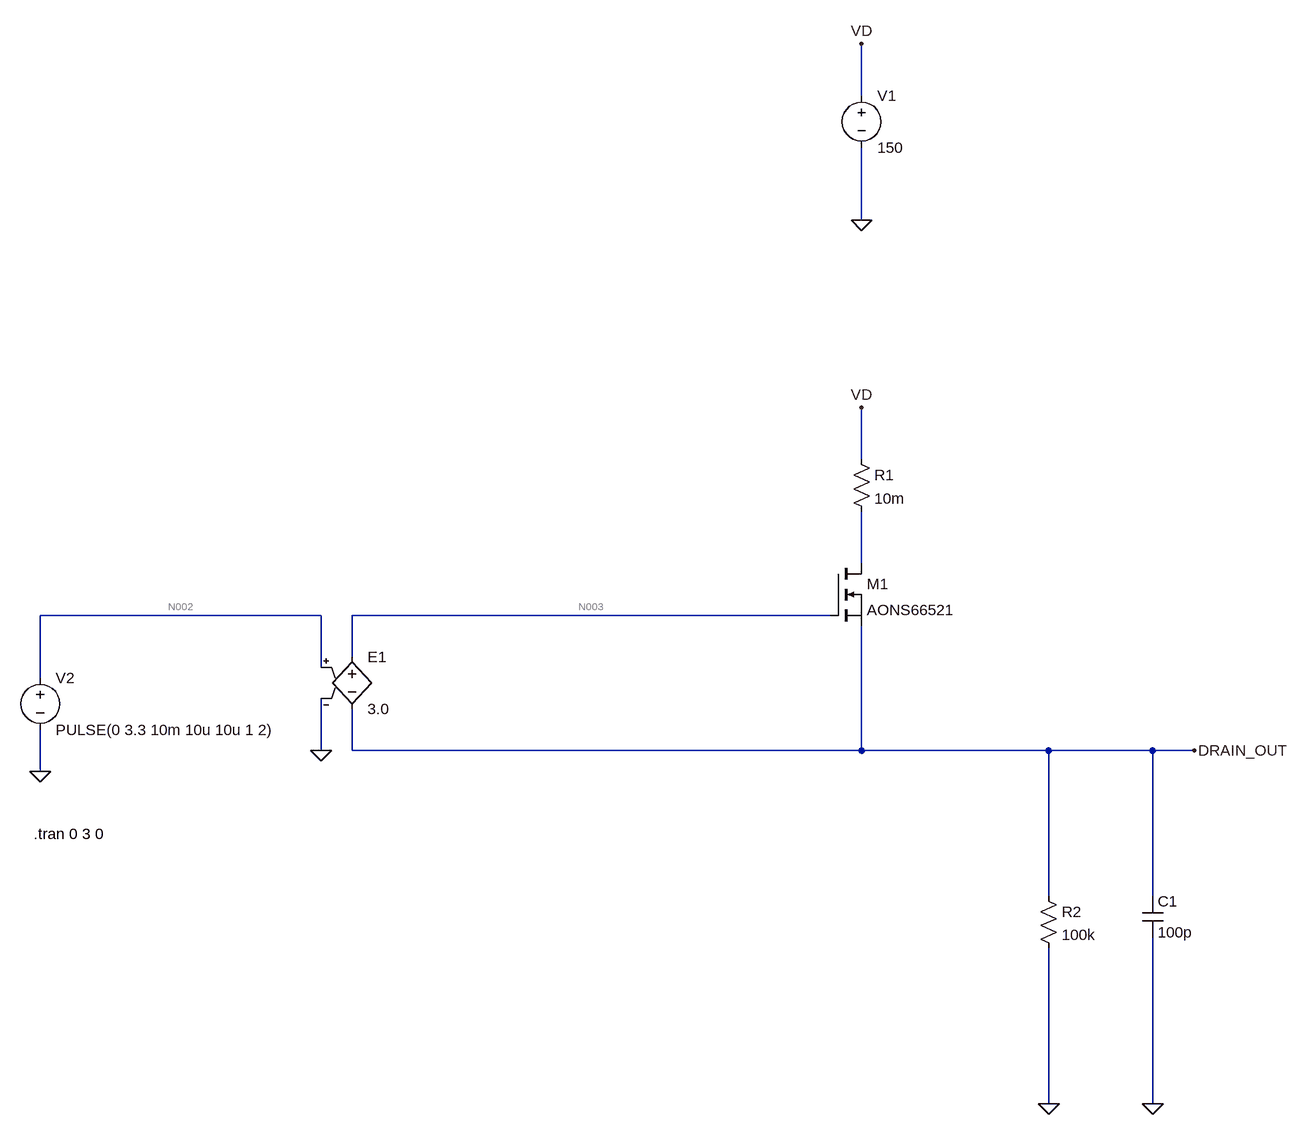
[diagram p0: schematic High_Side_Gate_Driver.asc]
High_Side_Gate_Driver.asc, the LTspice schematic file:
Version 4
SHEET 1 880 680
WIRE 192 -1072 192 -1152
WIRE 192 -880 192 -992
WIRE 192 -512 192 -592
WIRE 192 -352 192 -432
WIRE -640 -272 -1072 -272
WIRE 144 -272 -592 -272
WIRE -592 -208 -592 -272
WIRE -640 -192 -640 -272
WIRE -1072 -176 -1072 -272
WIRE -640 -64 -640 -144
WIRE -592 -64 -592 -128
WIRE 192 -64 192 -256
WIRE 192 -64 -592 -64
WIRE 480 -64 192 -64
WIRE 640 -64 480 -64
WIRE 704 -64 640 -64
WIRE -1072 -32 -1072 -96
WIRE 480 160 480 -64
WIRE 640 160 640 -64
WIRE 480 480 480 240
WIRE 640 480 640 224
FLAG 192 -592 VD
FLAG 192 -1152 VD
FLAG 192 -880 0
FLAG 704 -64 DRAIN_OUT
FLAG 480 480 0
FLAG 640 480 0
FLAG -1072 -32 0
FLAG -640 -64 0
SYMBOL nmos 144 -352 R0
SYMATTR InstName M1
SYMATTR Value AONS66521
SYMBOL voltage 192 -1088 R0
WINDOW 123 0 0 Left 0
WINDOW 39 0 0 Left 0
SYMATTR InstName V1
SYMATTR Value 150
SYMBOL res 176 -528 R0
SYMATTR InstName R1
SYMATTR Value 10m
SYMBOL res 464 144 R0
SYMATTR InstName R2
SYMATTR Value 100k
SYMBOL cap 624 160 R0
SYMATTR InstName C1
SYMATTR Value 100p
SYMBOL voltage -1072 -192 R0
WINDOW 123 0 0 Left 0
WINDOW 39 0 0 Left 0
SYMATTR InstName V2
SYMATTR Value PULSE(0 3.3 10m 10u 10u 1 2)
SYMBOL e -592 -224 R0
SYMATTR InstName E1
SYMATTR Value 3.0
TEXT -1082 64 Left 2 !.tran 0 3 0

The netlist it stands for:
* High_Side_Gate_Driver.asc
M1 N001 N003 DRAIN_OUT DRAIN_OUT AONS66521
V1 VD 0 150
R1 VD N001 10m
R2 DRAIN_OUT 0 100k
C1 DRAIN_OUT 0 100p
V2 N002 0 PULSE(0 3.3 10m 10u 10u 1 2)
E1 N003 DRAIN_OUT N002 0 3.0
.model NMOS NMOS
.model PMOS PMOS
.lib standard.mos
.tran 0 3 0
.backanno
.end

* Results of the author's LTspice run, read from the files saved beside the schematic
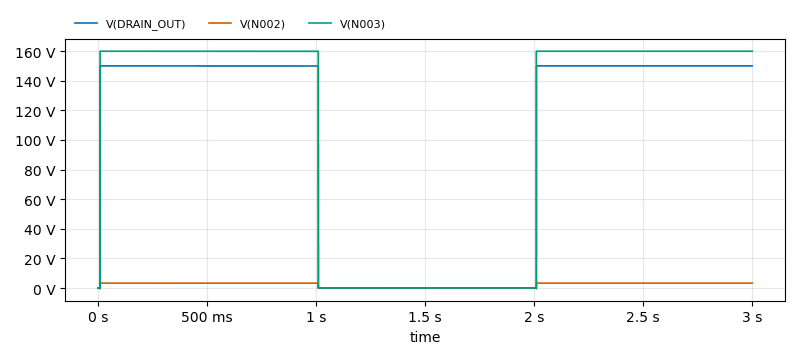
[diagram p1: Transient Analysis of High_Side_Gate_Driver.asc, plotted from the saved traces]
* Transient Analysis, 1 run:
*   V(DRAIN_OUT): min -565.9 mV, max 150 V, average 99.5 V, rms 122.2 V, last 150 V
*   V(N002): min 0 V, max 3.3 V, average 2.189 V, rms 2.688 V, last 3.3 V
*   V(N003): min 28.46 µV, max 159.9 V, average 106.1 V, rms 130.2 V, last 159.9 V